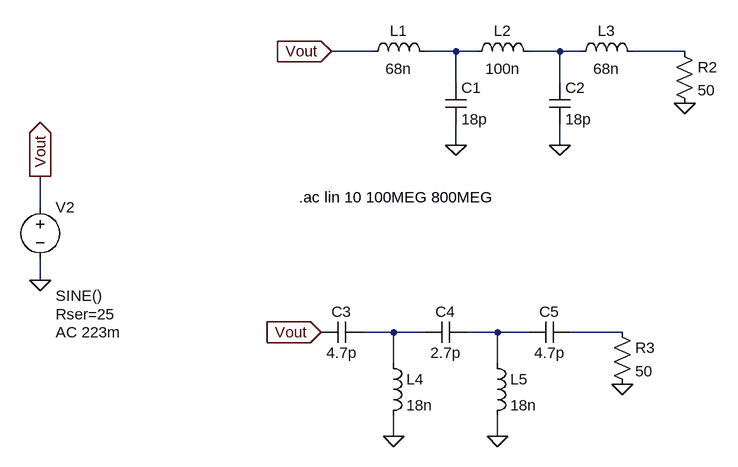
[diagram p0: schematic spice model.asc]
spice model.asc, the LTspice schematic file:
Version 4
SHEET 1 880 832
WIRE 96 144 32 144
WIRE 224 144 176 144
WIRE 256 144 224 144
WIRE 384 144 336 144
WIRE 416 144 384 144
WIRE 576 144 496 144
WIRE 224 192 224 144
WIRE 384 192 384 144
WIRE 224 288 224 256
WIRE 384 288 384 256
WIRE -416 384 -416 336
WIRE -416 496 -416 464
WIRE 128 576 80 576
WIRE 176 576 128 576
WIRE 288 576 240 576
WIRE 336 576 288 576
WIRE 480 576 400 576
WIRE 128 624 128 576
WIRE 288 624 288 576
WIRE 128 736 128 704
WIRE 288 736 288 704
FLAG 224 288 0
FLAG 384 288 0
FLAG 576 224 0
FLAG -416 496 0
FLAG 128 736 0
FLAG 288 736 0
FLAG 480 656 0
FLAG -416 336 Vout
IOPIN -416 336 Out
FLAG 16 576 Vout
IOPIN 16 576 In
FLAG 32 144 Vout
IOPIN 32 144 In
SYMBOL ind 80 160 R270
WINDOW 0 32 56 VTop 2
WINDOW 3 5 56 VBottom 2
SYMATTR InstName L1
SYMATTR Value 68n
SYMBOL ind 240 160 R270
WINDOW 0 32 56 VTop 2
WINDOW 3 5 56 VBottom 2
SYMATTR InstName L2
SYMATTR Value 100n
SYMBOL ind 400 160 R270
WINDOW 0 32 56 VTop 2
WINDOW 3 5 56 VBottom 2
SYMATTR InstName L3
SYMATTR Value 68n
SYMBOL cap 208 192 R0
SYMATTR InstName C1
SYMATTR Value 18p
SYMBOL cap 368 192 R0
SYMATTR InstName C2
SYMATTR Value 18p
SYMBOL res 560 128 R0
SYMATTR InstName R2
SYMATTR Value 50
SYMBOL cap 80 560 R90
WINDOW 0 0 32 VBottom 2
WINDOW 3 32 32 VTop 2
SYMATTR InstName C3
SYMATTR Value 4.7p
SYMBOL cap 240 560 R90
WINDOW 0 0 32 VBottom 2
WINDOW 3 32 32 VTop 2
SYMATTR InstName C4
SYMATTR Value 2.7p
SYMBOL cap 400 560 R90
WINDOW 0 0 32 VBottom 2
WINDOW 3 32 32 VTop 2
SYMATTR InstName C5
SYMATTR Value 4.7p
SYMBOL ind 112 608 R0
SYMATTR InstName L4
SYMATTR Value 18n
SYMBOL ind 272 608 R0
SYMATTR InstName L5
SYMATTR Value 18n
SYMBOL voltage -416 368 R0
WINDOW 3 24 152 Left 2
WINDOW 123 24 208 Left 2
WINDOW 39 24 180 Left 2
SYMATTR InstName V2
SYMATTR Value SINE()
SYMATTR Value2 AC 223m
SYMATTR SpiceLine Rser=25
SYMBOL res 464 560 R0
SYMATTR InstName R3
SYMATTR Value 50
TEXT -18 368 Left 2 !.ac lin 10 100MEG 800MEG

The netlist it stands for:
* spice model.asc
L1 Vout N001 68n
L2 N001 N002 100n
L3 N002 N003 68n
C1 N001 0 18p
C2 N002 0 18p
R2 N003 0 50
C3 N004 Vout 4.7p
C4 N005 N004 2.7p
C5 N006 N005 4.7p
L4 N004 0 18n
L5 N005 0 18n
V2 Vout 0 SINE() AC 223m Rser=25
R3 N006 0 50
.ac lin 10 100MEG 800MEG
.backanno
.end